# EAGLE design XLR-M Breakout (EAGLE 9.4.2)
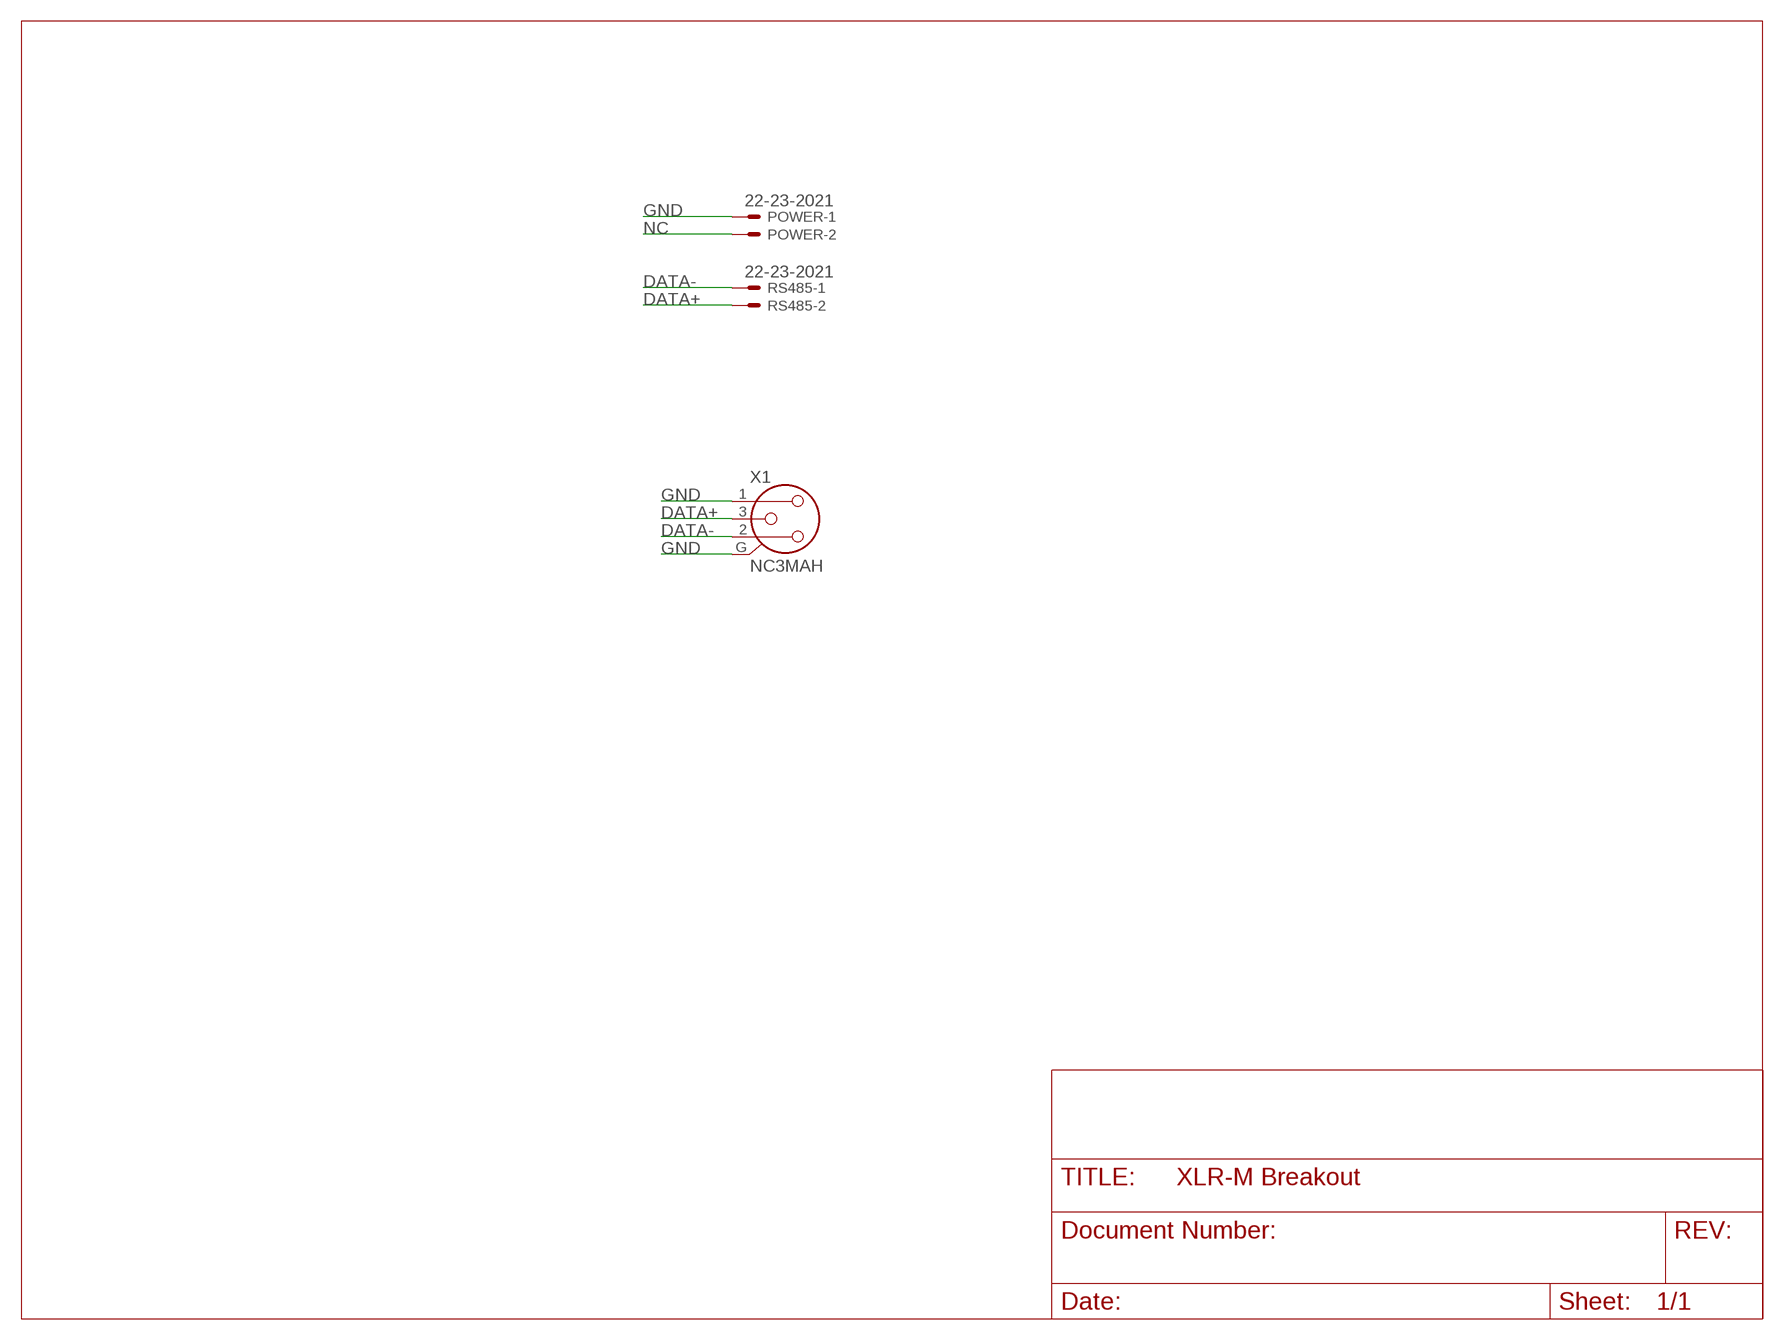
[diagram p0: schematic, sheet 1]

## Parts
POWER  22-23-2021  [22-23-2021]
RS485  22-23-2021  [22-23-2021]
X1  NC3MAH  NC3MBH  [NC3MBH]

## Nets
DATA+: RS485.2 X1.3
DATA-: RS485.1 X1.2
GND: POWER.1 X1.1 X1.G
NC: POWER.2

## Library data of the parts
POWER RS485 = con-molex:22-23-2021: .100" (2.54mm) Center Header - 2 Pin; MF: MOLEX; MPN: 22-23-2021; OC_FARNELL: 1462926; OC_NEWARK: 25C3832
X1 = con-neutrik_ag:NC3: Neutrik Audio Connector XLR SERIES Stereo 1/4" jack Source: www.neutrik.com/; MF: NEUTRIK; MPN: NC3MBH; OC_FARNELL: unknown; OC_NEWARK: 91F3470

## Board
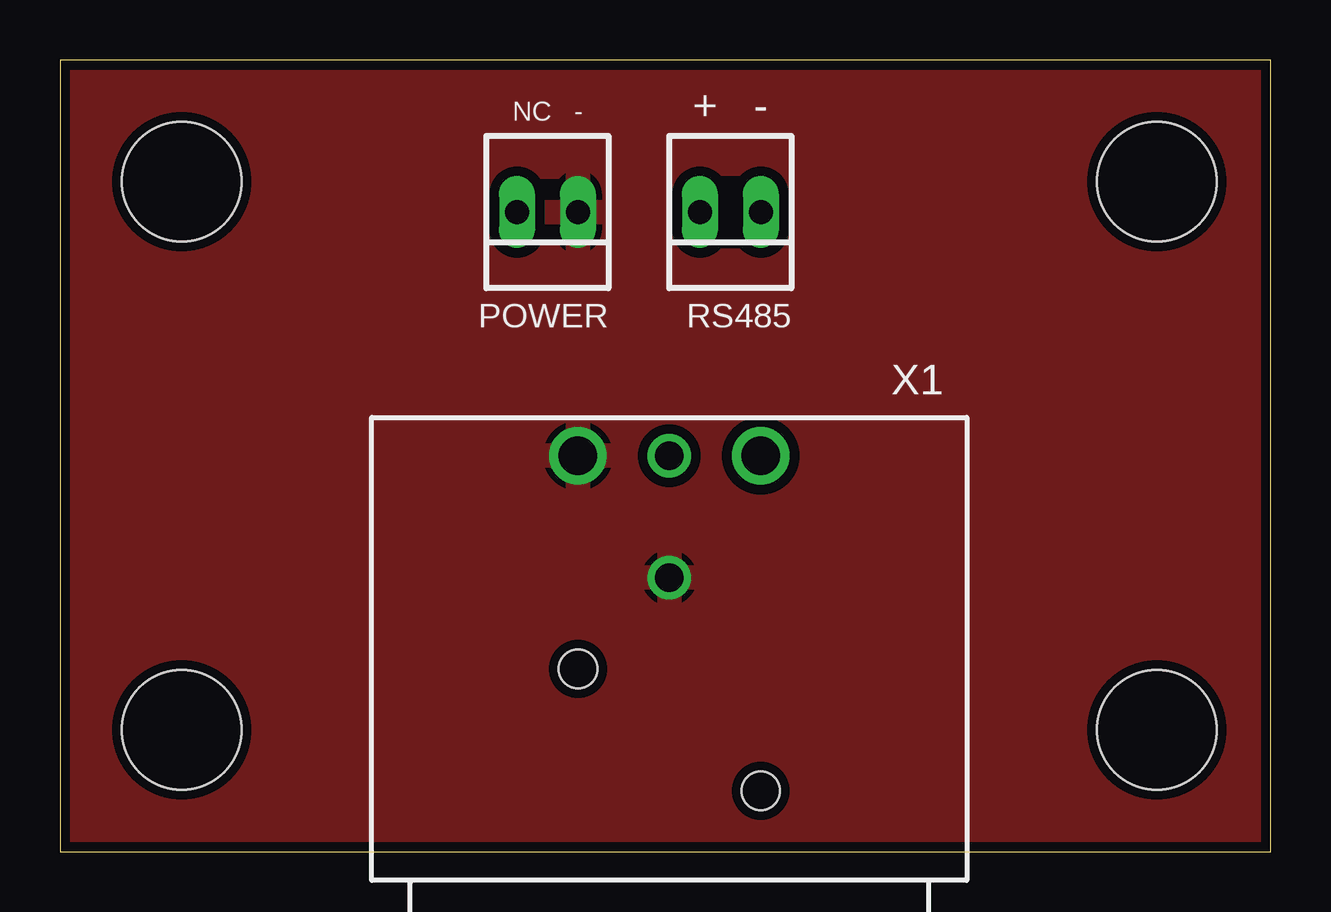
[diagram p1: board, top side]
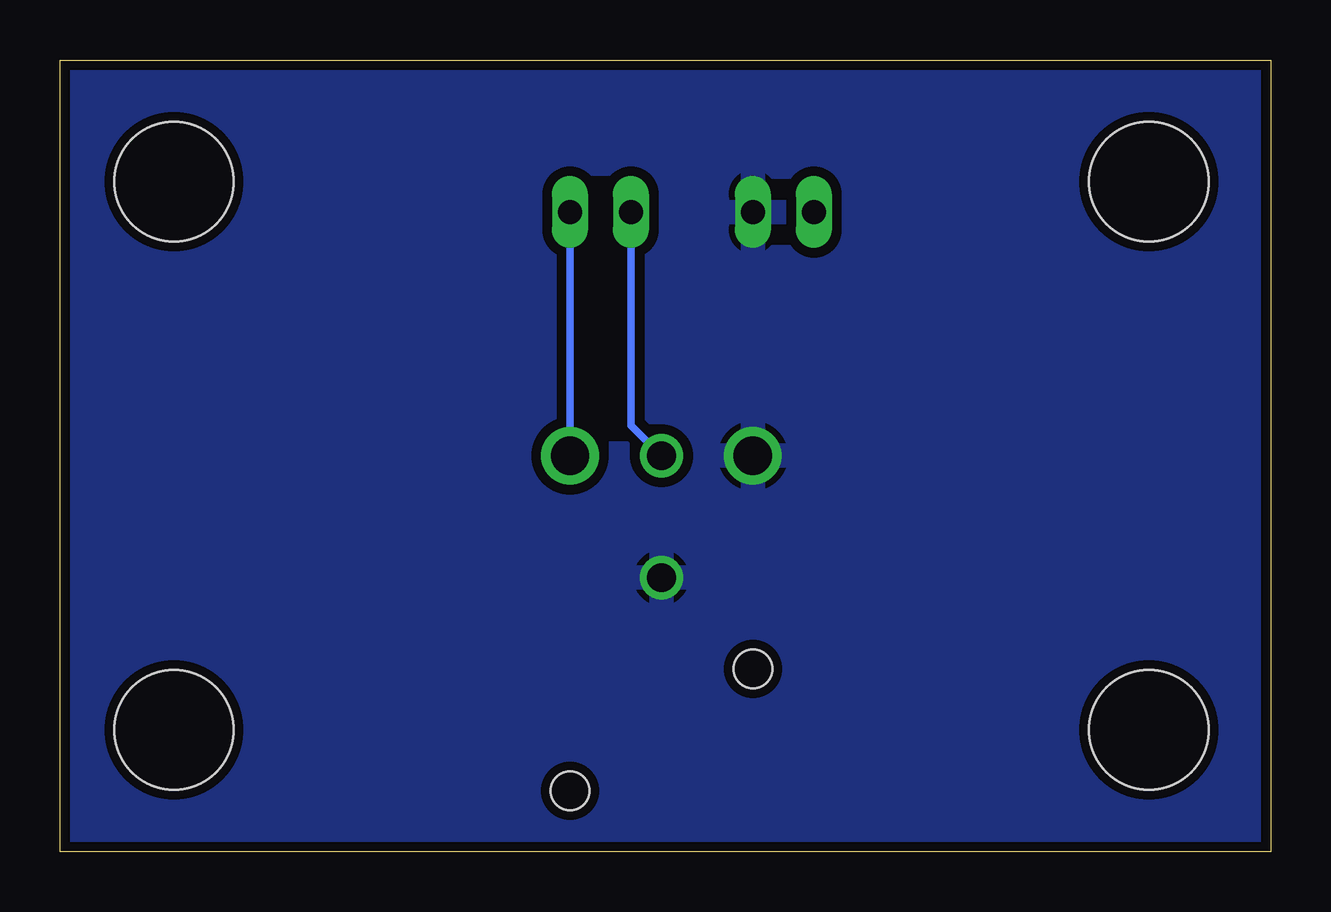
[diagram p2: board, bottom side, seen from below]

Size 50.47 x 33.01 mm. Coordinates in mm from the lower left corner, seen from the top.
Outline: 0,0 50.47,0 50.47,33.01 0,33.01 0,0
Copper layers (1*16): Top 0.035559375mm / dielectric 1.6mm / Bottom 0.035559375mm
Design rules "default": minimum track width 6mil, minimum drill 10mil, track to track 6mil, track to pad 6mil, pad to pad 6mil, via to via 6mil, smd to smd 6mil, copper to edge 15mil, drill to drill 6mil, minimum pad ring 5mil, minimum via ring 5mil, stop-mask expansion 2.5mil, vias tented up to drill 0mil, thermal gap 10mil
Holes 4.98 mm at 5.08,5.08 45.72,5.08 5.08,27.94 45.72,27.94

### Footprints (pad centres in the part's own frame; a part is rotated, then mirrored left to right if it is on the bottom)
22-23-2021 = drill 1 long: 1 -1.27,0; 2 1.27,0
NC3MBH = drill 1.6: 1 3.81,0; 2 -3.81,0 | drill 1.2: 3 0,0; G 0,5.08 | hole 1.6: -3.81,13.97; 3.81,8.89

### Placement (x,y rotation side)
POWER  20.32,26.67 180 top
RS485  27.94,26.67 180 top
X1  25.4,16.51 180 top

### Tracks (layer width: path | path; a pad name or v marks a point on that pad's centre or on a via)
DATA+
  Bottom 0.305: RS485.2 26.67,17.78 X1.3
DATA-
  Bottom 0.305: RS485.1 X1.2
GND
  pour Top (isolate 0.406): 0,33.02 50.8,33.02 50.8,0 0,0
  pour Bottom (isolate 0.406): 0,33.02 50.8,33.02 50.8,5.08 53.34,2.54 53.34,0 0,0

### Text on the board
tNames: NC - | + -